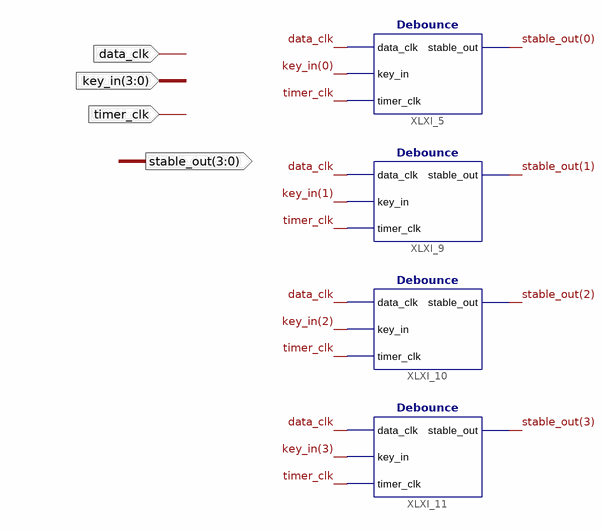
[diagram p0: schematic sheet 1]
// Xilinx ISE schematic RowDebouncer.sch (spartan3e) as structural Verilog: 4 symbols, 4 ports
module RowDebouncer (
  input  timer_clk,
  input  data_clk,
  input  [3:0] key_in,
  output [3:0] stable_out
);

  Debounce XLXI_10 (.data_clk(data_clk), .key_in(key_in[2]), .timer_clk(timer_clk), .stable_out(stable_out[2]));
  Debounce XLXI_11 (.data_clk(data_clk), .key_in(key_in[3]), .timer_clk(timer_clk), .stable_out(stable_out[3]));
  Debounce XLXI_5 (.data_clk(data_clk), .key_in(key_in[0]), .timer_clk(timer_clk), .stable_out(stable_out[0]));
  Debounce XLXI_9 (.data_clk(data_clk), .key_in(key_in[1]), .timer_clk(timer_clk), .stable_out(stable_out[1]));
endmodule
